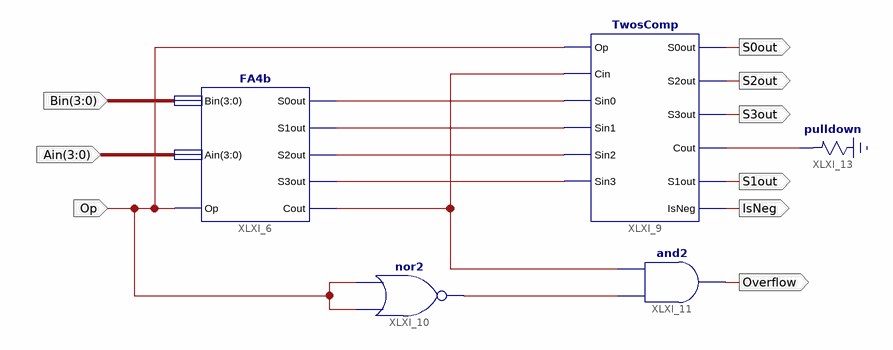
[diagram p0: schematic sheet 1]
// Xilinx ISE schematic Lab5Exp3.sch (spartan3e) as structural Verilog: 5 symbols, 9 ports
module Lab5Exp3 (
  input  [3:0] Bin,
  input  [3:0] Ain,
  input  Op,
  output S0out,
  output S2out,
  output S3out,
  output S1out,
  output IsNeg,
  output Overflow
);

  wire Cout, XLXN_13, XLXN_14, XLXN_15, XLXN_16, XLXN_40, XLXN_47;

  FA4b XLXI_6 (
    .Bin(Bin), .Ain(Ain), .Op(Op), .S0out(XLXN_13), .S1out(XLXN_14), .S2out(XLXN_15), .S3out(XLXN_16),
    .Cout(Cout));
  TwosComp XLXI_9 (
    .Op(Op), .Cin(Cout), .Sin0(XLXN_13), .Sin1(XLXN_14), .Sin2(XLXN_15), .Sin3(XLXN_16), .S0out(S0out),
    .S2out(S2out), .S3out(S3out), .Cout(XLXN_40), .IsNeg(IsNeg), .S1out(S1out));
  nor XLXI_10 (XLXN_47, Op, Op);
  and XLXI_11 (Overflow, XLXN_47, Cout);
  \pulldown  XLXI_13 (.O(XLXN_40));
endmodule
